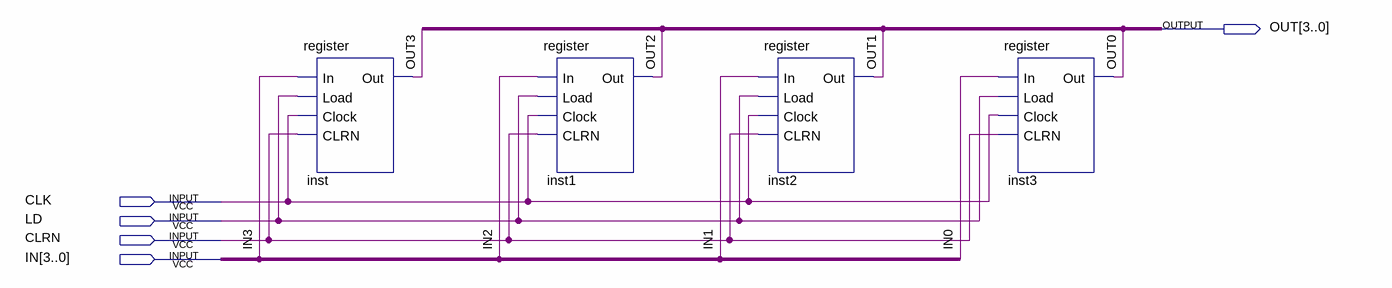
[diagram p0: schematic sheet]
// Quartus schematic reg4b.bdf as structural Verilog: 4 symbols, 5 pins
module reg4b (
  input  CLK,
  input  LD,
  input  CLRN,
  input  [3:0] IN,
  output [3:0] OUT
);

  register inst (.In(IN[3]), .Load(LD), .Clock(CLK), .CLRN(CLRN), .Out(OUT[3]));
  register inst1 (.In(IN[2]), .Load(LD), .Clock(CLK), .CLRN(CLRN), .Out(OUT[2]));
  register inst2 (.In(IN[1]), .Load(LD), .Clock(CLK), .CLRN(CLRN), .Out(OUT[1]));
  register inst3 (.In(IN[0]), .Load(LD), .Clock(CLK), .CLRN(CLRN), .Out(OUT[0]));
endmodule
